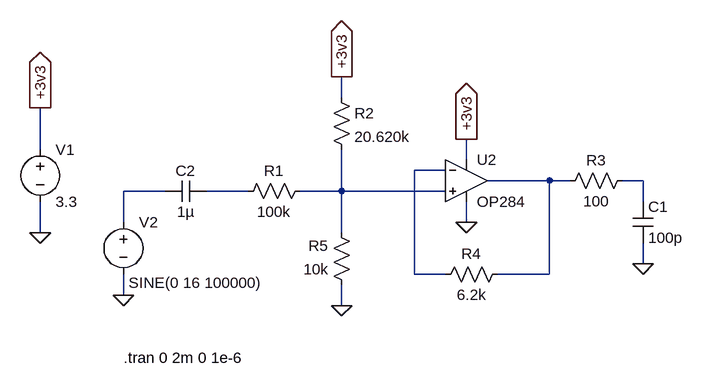
[diagram p0: schematic adc_driver.asc]
adc_driver.asc, the LTspice schematic file:
Version 4
SHEET 1 888 680
WIRE 352 48 352 16
WIRE -112 128 -112 64
WIRE 544 144 544 112
WIRE 512 160 464 160
WIRE 672 176 576 176
WIRE 704 176 672 176
WIRE 816 176 784 176
WIRE 80 192 16 192
WIRE 208 192 144 192
WIRE 352 192 352 128
WIRE 352 192 288 192
WIRE 512 192 352 192
WIRE 816 208 816 176
WIRE 16 240 16 192
WIRE 544 240 544 208
WIRE -112 256 -112 208
WIRE 352 256 352 192
WIRE 816 304 816 272
WIRE 464 320 464 160
WIRE 512 320 464 320
WIRE 672 320 672 176
WIRE 672 320 592 320
WIRE 16 352 16 320
WIRE 352 368 352 336
FLAG -112 256 0
FLAG -112 64 +3v3
IOPIN -112 64 Out
FLAG 544 112 +3v3
IOPIN 544 112 Out
FLAG 16 352 0
FLAG 352 368 0
FLAG 352 16 +3v3
IOPIN 352 16 Out
FLAG 544 240 0
FLAG 816 304 0
SYMBOL voltage -112 112 R0
WINDOW 123 0 0 Left 0
WINDOW 39 0 0 Left 0
SYMATTR InstName V1
SYMATTR Value 3.3
SYMBOL voltage 16 224 R0
WINDOW 3 8 109 Left 2
WINDOW 123 0 0 Left 0
WINDOW 39 0 0 Left 0
SYMATTR Value SINE(0 16 100000)
SYMATTR InstName V2
SYMBOL res 304 176 R90
WINDOW 0 0 56 VBottom 2
WINDOW 3 32 56 VTop 2
SYMATTR InstName R1
SYMATTR Value 100k
SYMBOL res 336 32 R0
SYMATTR InstName R2
SYMATTR Value 20.620k
SYMBOL res 800 160 R90
WINDOW 0 0 56 VBottom 2
WINDOW 3 32 56 VTop 2
SYMATTR InstName R3
SYMATTR Value 100
SYMBOL res 608 304 R90
WINDOW 0 0 56 VBottom 2
WINDOW 3 32 56 VTop 2
SYMATTR InstName R4
SYMATTR Value 6.2k
SYMBOL res 368 352 R180
WINDOW 0 36 76 Left 2
WINDOW 3 36 40 Left 2
SYMATTR InstName R5
SYMATTR Value 10k
SYMBOL cap 800 208 R0
SYMATTR InstName C1
SYMATTR Value 100p
SYMBOL cap 144 176 R90
WINDOW 0 0 32 VBottom 2
WINDOW 3 32 32 VTop 2
SYMATTR InstName C2
SYMATTR Value 1µ
SYMBOL Opamps\\OP284 544 112 R0
SYMATTR InstName U2
TEXT 16 448 Left 2 !.tran 0 2m 0 1e-6

The netlist it stands for:
* adc_driver.asc
V1 +3v3 0 3.3
V2 N004 0 SINE(0 16 100000)
R1 N006 N005 100k
R2 +3v3 N006 20.620k
R3 N003 N002 100
R4 N002 N001 6.2k
R5 0 N006 10k
C1 N003 0 100p
C2 N005 N004 1µ
XU2 N006 N001 +3v3 0 N002 OP284  ; pins In+ In- V+ V- OUT
.tran 0 2m 0 1e-6
.lib ADI1.lib
.backanno
.end